# EAGLE design H1DR0x-AD (EAGLE 9.6.1)
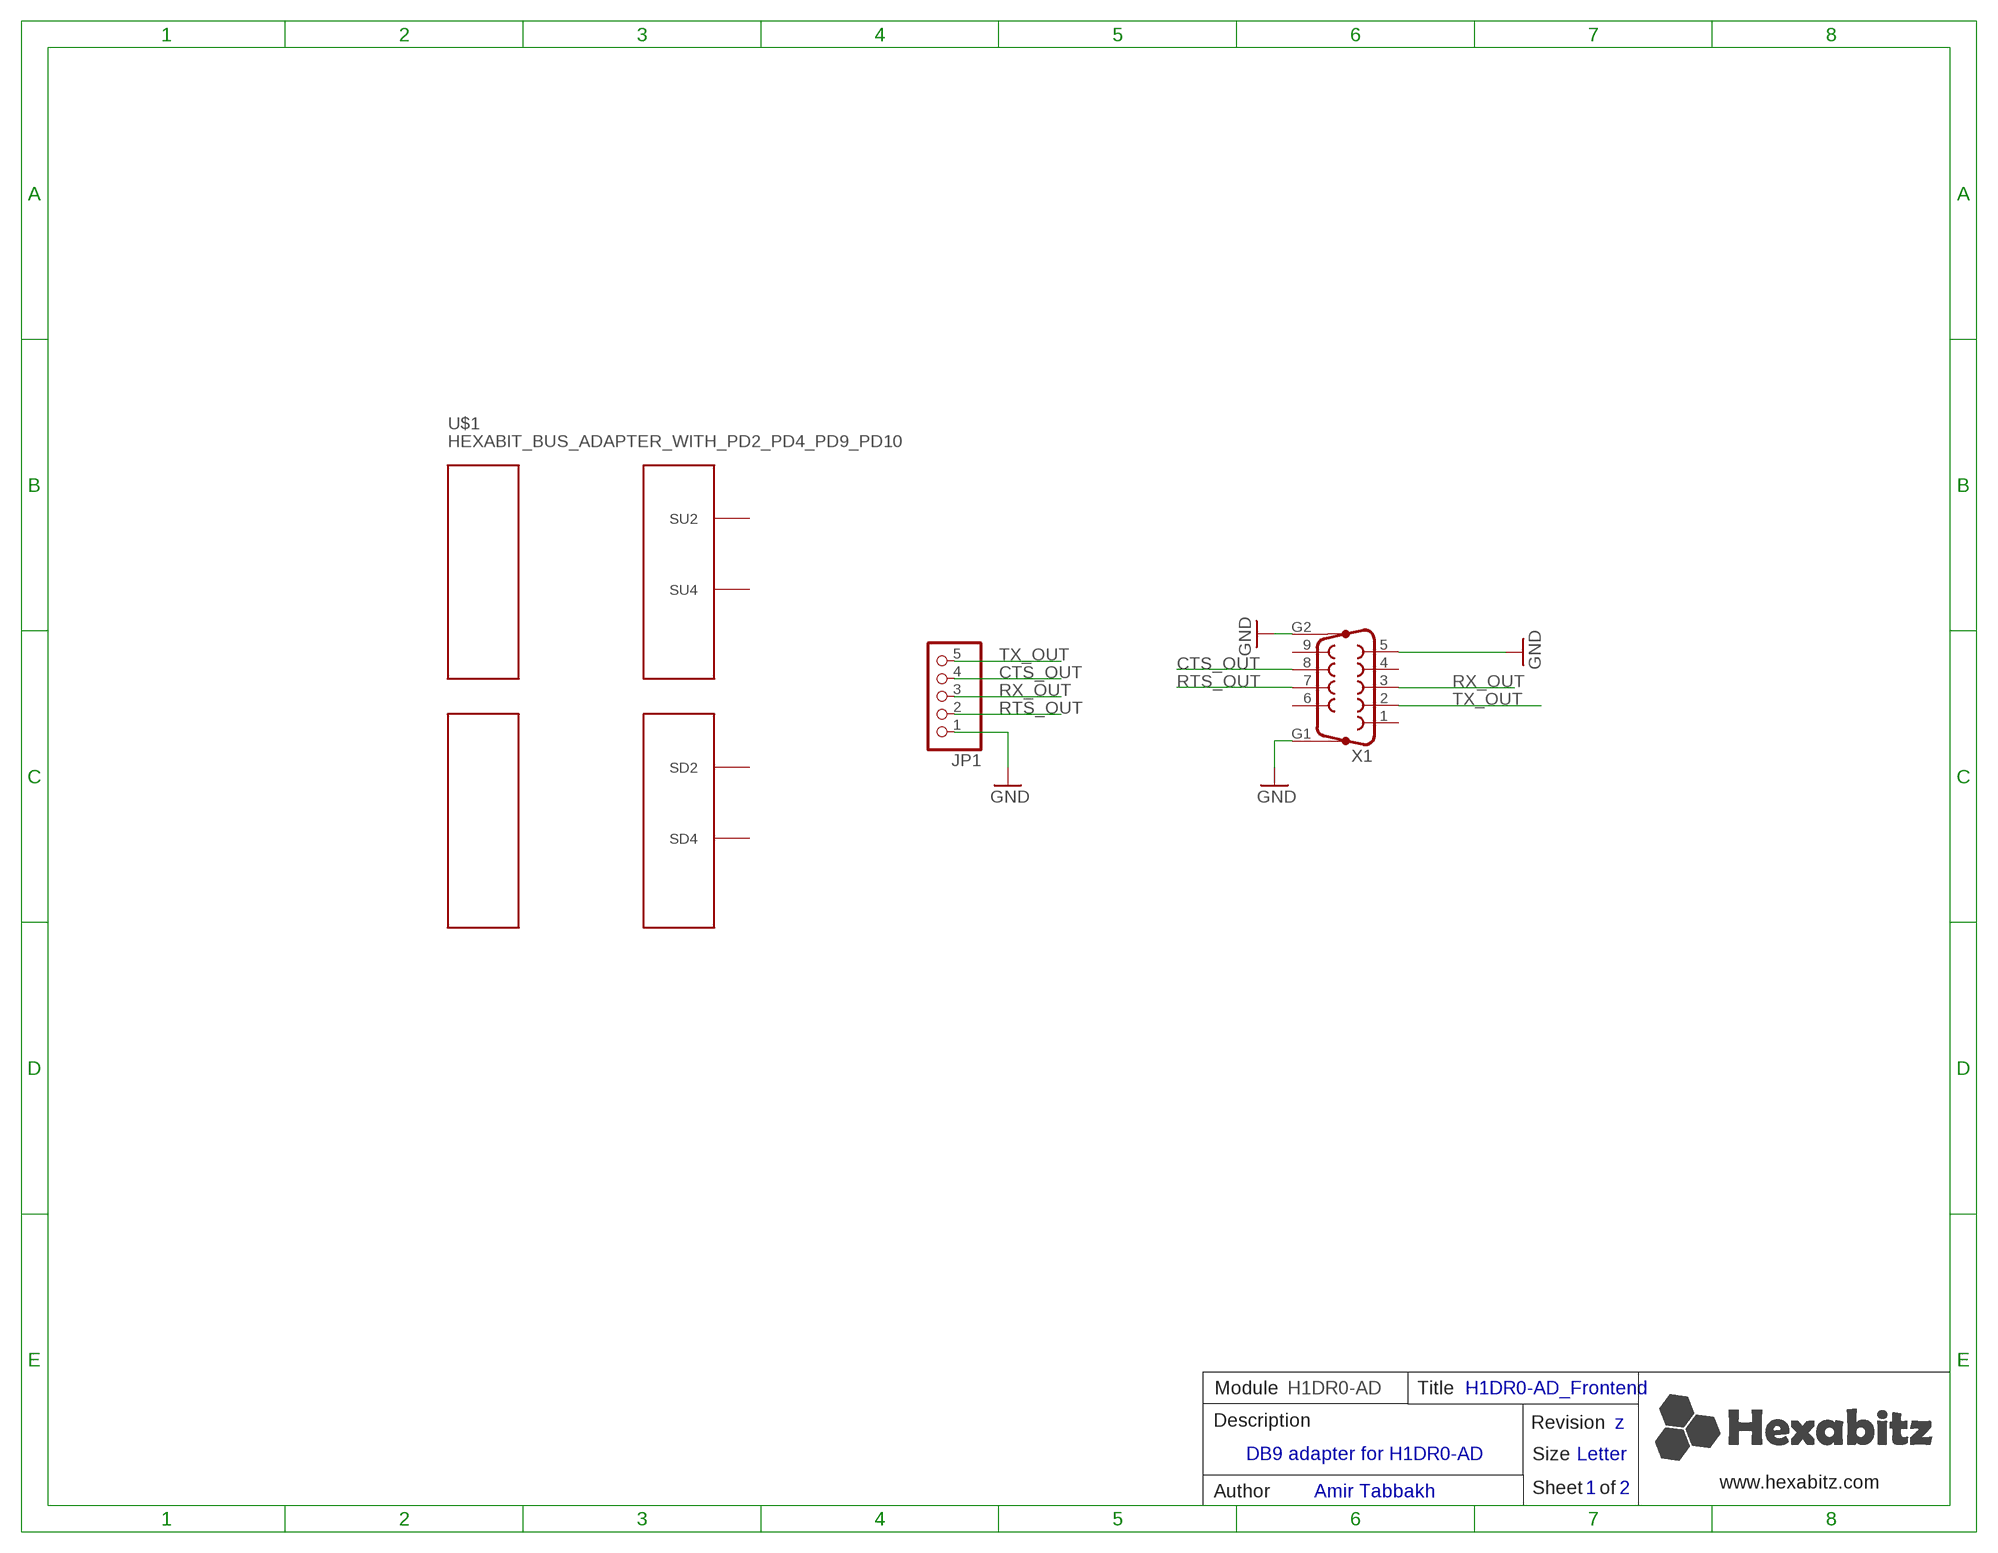
[diagram p0: schematic, sheet 1]

## Parts
JP1  PINHD-1X5  [F_1X05]
U$1  HEXABIT_BUS_ADAPTER_WITH_PD2_PD4_PD9_PD10  [HEXABIT_BUS_ADAPTER_WITH_P2_P4]
X1  F09HP  [F09HP]

## Nets
CTS_OUT: JP1.4 X1.8
GND: JP1.1 X1.5 X1.G1 X1.G2
RTS_OUT: JP1.2 X1.7
RX_OUT: JP1.3 X1.3
TX_OUT: JP1.5 X1.2
Unconnected: U$1.PAD_PD2(SD2) U$1.PAD_PD4(SD4) U$1.PAD_PU2(SU2) U$1.PAD_PU4(SU4) X1.1 X1.4 X1.6 X1.9

## Notes on the sheet
- Module | H1DR0-AD | Title | H1DR0-AD_Frontend
- Description | Revision | z
- DB9 adapter for H1DR0-AD
- Size | Letter
- www.hexabitz.com
- Author | Amir Tabbakh | Sheet   of | 1 | 2

## Library data of the parts
JP1 = Hexabitz:PINHD-1X5: PIN HEADER Female right angle; DESCRITION: Female, 5C, Rt Angle .100"CC; 3.15mm Tail, No Mt. 100u" Tin; PBT, Phos Bronze, 105 C; MFN: Sullins; MPN: PPTC051LGBN-RC; OCTOPART_URL: https://octopart.com/pptc051lgbn-rc-sullins-270345?r=sp
U$1 = hexabitz_connectors:HEXABIT_BUS_ADAPTER_WITH_PD2_PD4_PD9_PD10
X1 = Hexabitz:F09HP: SUB-D; DESCRITION: 9 Position Dual Row Right Angle Through Hole Plug Male Pins D-Sub Connector; MFN: ASSMANN WSW Components; MPN: A-DS-09-A/KG-T2S; OCTOPART_URL: https://octopart.com/a-ds-09-a%2Fkg-t2s-assmann+wsw+components-56465222?r=sp; OC_FARNELL: unknown; OC_NEWARK: unknown

## Board
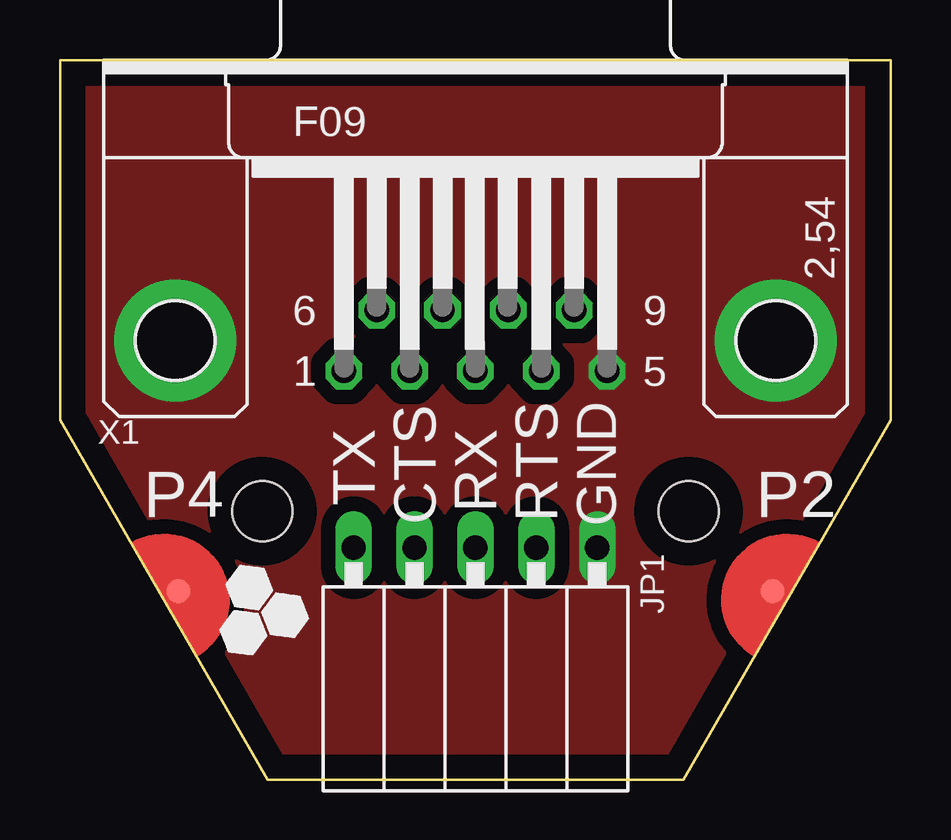
[diagram p1: board, top side]
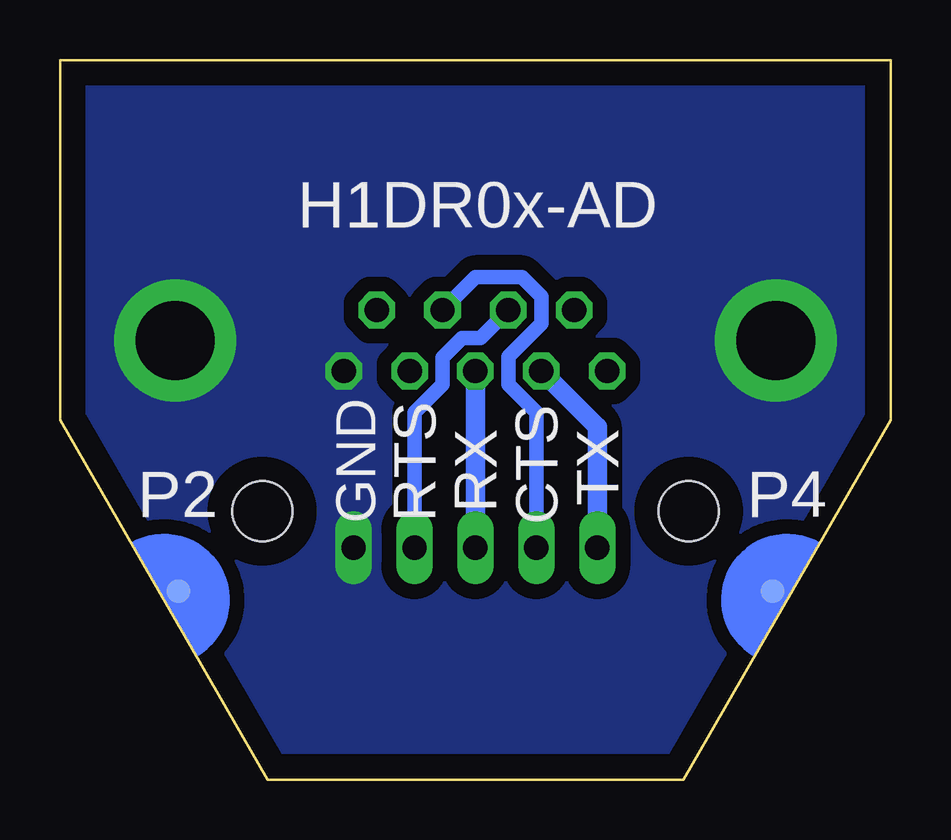
[diagram p2: board, bottom side, seen from below]

Size 34.64 x 30 mm. Coordinates in mm from the lower left corner, seen from the top.
Copper layers (1*16): Top 0.035mm / dielectric 0.15mm / Bottom 0.035mm
Design rules "default *": minimum track width 6mil, minimum drill 0.35mm, track to track 12mil, track to pad 12mil, pad to pad 6mil, via to via 6mil, smd to smd 6mil, copper to edge 40mil, drill to drill 6mil, minimum pad ring 10mil, minimum via ring 8mil, stop-mask expansion 4mil, vias tented up to drill 0mil, thermal gap 10mil

### Footprints (pad centres in the part's own frame; a part is rotated, then mirrored left to right if it is on the bottom)
F_1X05 = drill 1.016 long: 1 -5.08,-2.54; 2 -2.54,-2.54; 3 0,-2.54; 4 2.54,-2.54; 5 5.08,-2.54
HEXABIT_BUS_ADAPTER_WITH_P2_P4 = smd 1 x 1 bottom: PAD_PD2 12.39,-7.15; PAD_PD4 -12.39,-7.15 | smd 1 x 1: PAD_PU2 12.39,-7.15; PAD_PU4 -12.39,-7.15 | hole 2.5: -8.89,-3.81; 8.89,-3.81
F09HP = drill 1.016 octagon: 1 -5.486,-1.27; 2 -2.743,-1.27; 3 0,-1.27; 4 2.743,-1.27; 5 5.486,-1.27; 6 -4.115,1.27; 7 -1.372,1.27; 8 1.372,1.27; 9 4.115,1.27 | drill 3.302 pad 5.08: G1 -12.522,0; G2 12.522,0

### Placement (x,y rotation side)
JP1  17.32,7.13 180 top
U$1  17.32,15 0 top
X1  17.32,18.3 0 top

### Tracks (layer width: path | path; a pad name or v marks a point on that pad's centre or on a via)
CTS_OUT
  Bottom 0.61: X1.8 17.32,20.94 15.38,20.94 14.58,20.14 14.58,19 15.95,17.63 15.95,16.46 14.78,15.29 JP1.4
GND
  pour Bottom (isolate 0.61, no thermals): -0.02,29.99 34.66,29.99 34.66,0.01 -0.02,0.01
  pour Top (isolate 0.61, no thermals): -0.02,29.99 34.66,29.99 34.66,15.06 34.66,0.08 34.66,-0.05 -0.02,-0.05
RTS_OUT
  Bottom 0.61: X1.7 17.12,18.4 17.89,18.4 18.69,17.6 18.69,16.46 19.86,15.29 JP1.2
RX_OUT
  Bottom 0.813: JP1.3 X1.3
TX_OUT
  Bottom 0.813: X1.2 12.24,14.7 JP1.5

### Text on the board
tPlace: CTS | RTS | GND | TX | RX | P4 | P2
bPlace: H1DR0x-AD | CTS | RTS | GND | TX | RX | P4 | P2